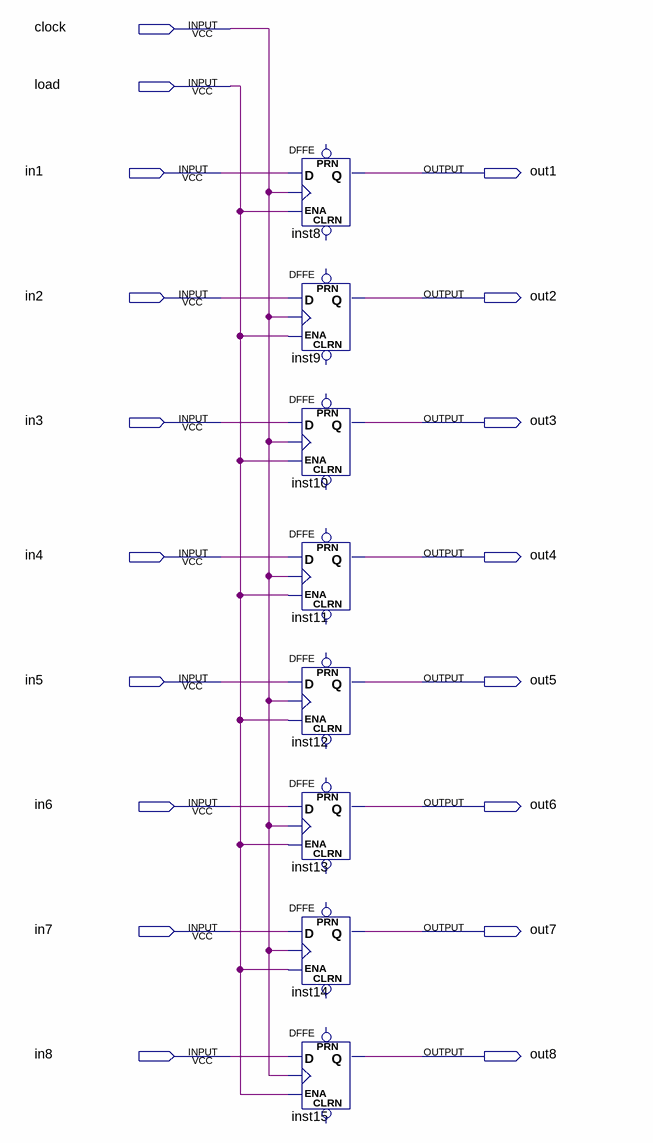
[diagram p0: schematic sheet]
// Quartus schematic reg2.bdf as structural Verilog: 8 symbols, 18 pins
module reg2 (
  input  clock,
  input  load,
  input  in1,
  input  in2,
  input  in3,
  input  in4,
  input  in5,
  input  in6,
  input  in7,
  input  in8,
  output out1,
  output out2,
  output out3,
  output out4,
  output out5,
  output out6,
  output out7,
  output out8
);

  DFFE inst8 (.D(in1), .CLK(clock), .ENA(load), .Q(out1));  // open: PRN, CLRN
  DFFE inst9 (.D(in2), .CLK(clock), .ENA(load), .Q(out2));  // open: PRN, CLRN
  DFFE inst10 (.D(in3), .CLK(clock), .ENA(load), .Q(out3));  // open: PRN, CLRN
  DFFE inst11 (.D(in4), .CLK(clock), .ENA(load), .Q(out4));  // open: PRN, CLRN
  DFFE inst12 (.D(in5), .CLK(clock), .ENA(load), .Q(out5));  // open: PRN, CLRN
  DFFE inst13 (.D(in6), .CLK(clock), .ENA(load), .Q(out6));  // open: PRN, CLRN
  DFFE inst14 (.D(in7), .CLK(clock), .ENA(load), .Q(out7));  // open: PRN, CLRN
  DFFE inst15 (.D(in8), .CLK(clock), .ENA(load), .Q(out8));  // open: PRN, CLRN
endmodule
